# EAGLE design twin coil rev 3 20170625c (EAGLE 7.3.0)
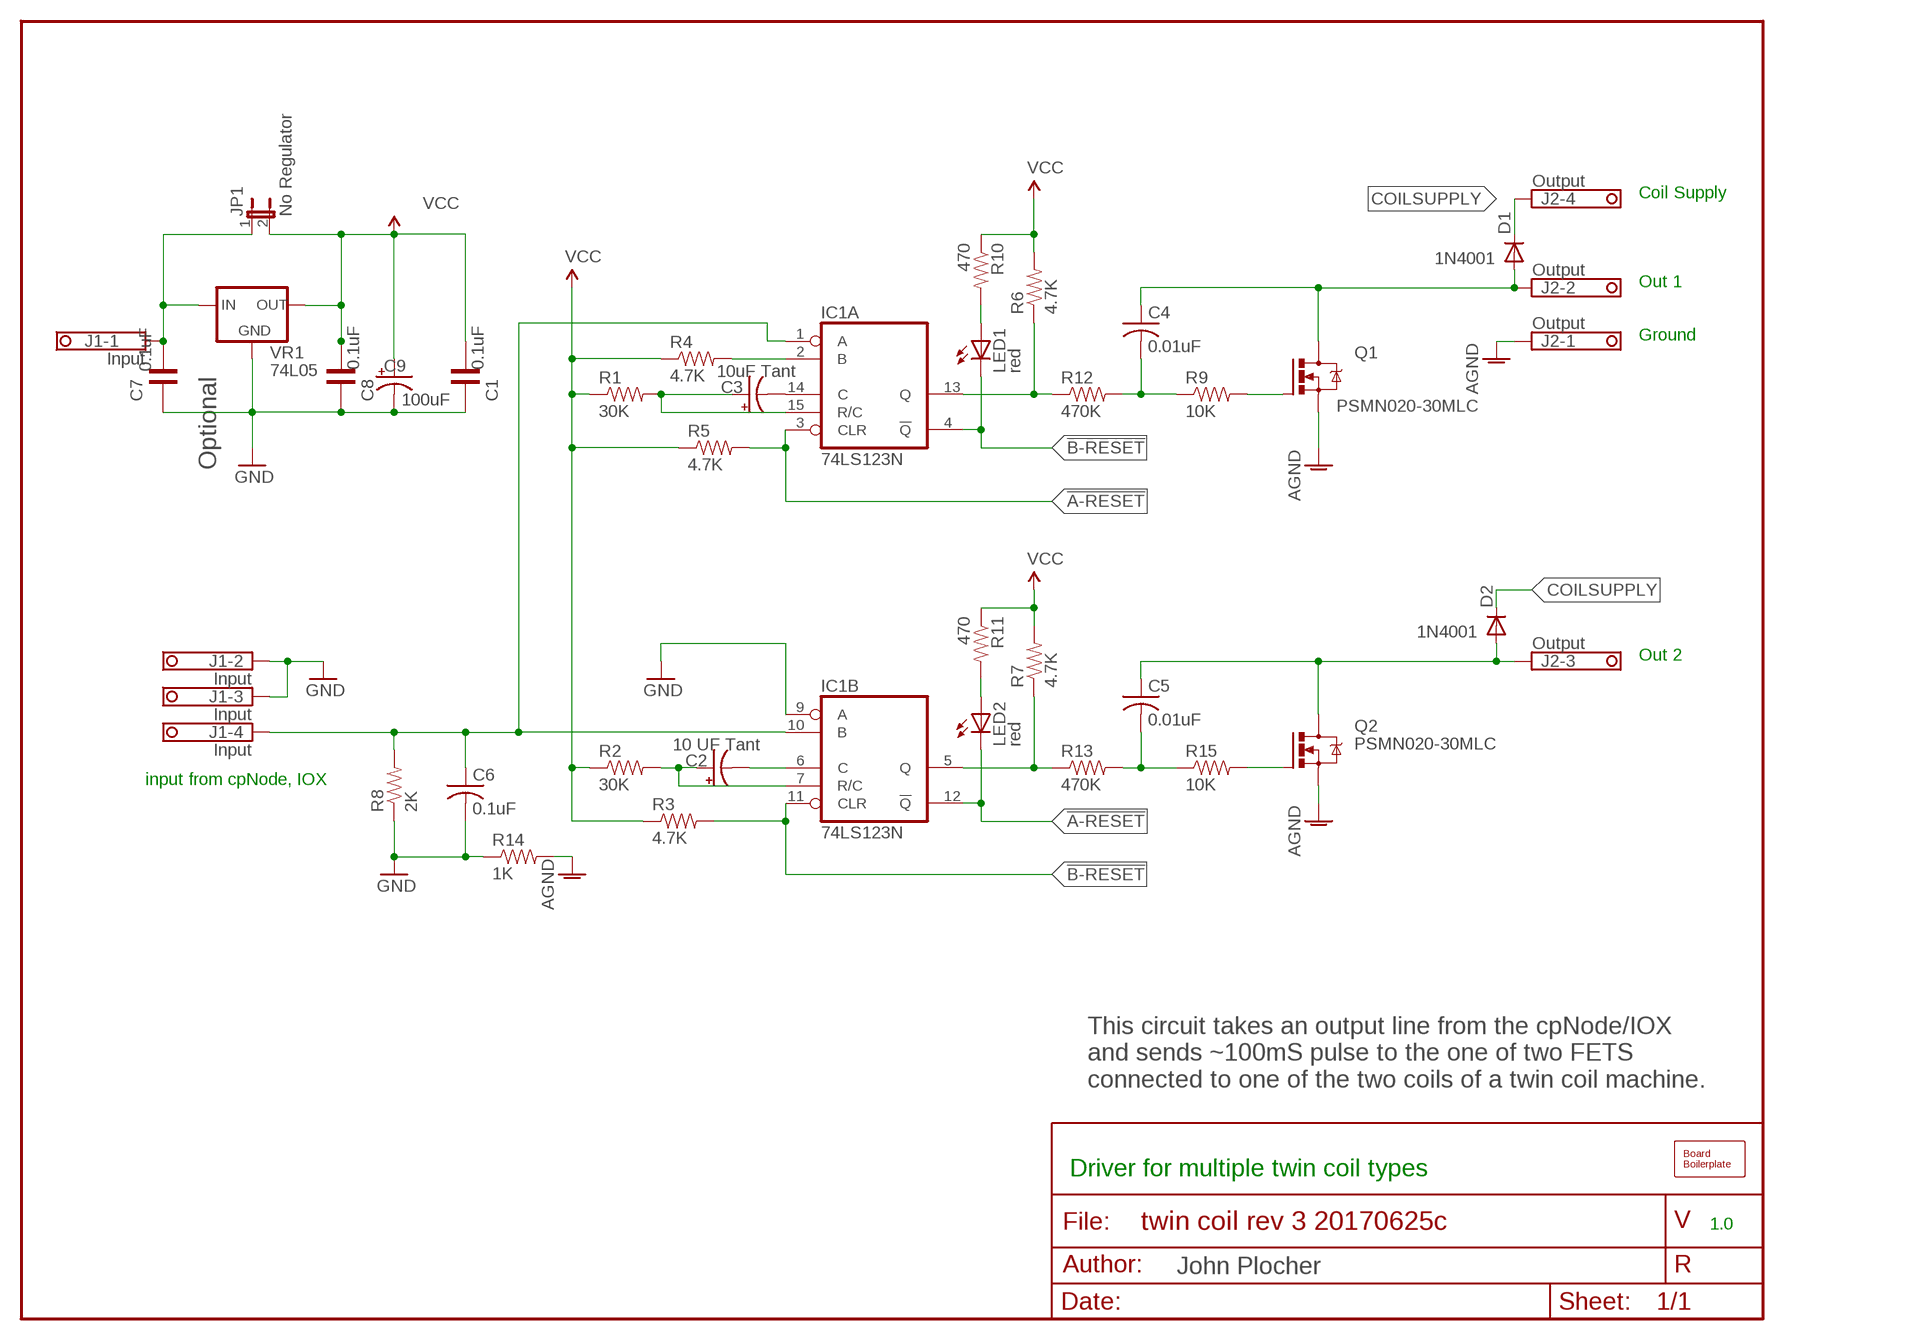
[diagram p0: schematic, sheet 1]

## Parts
BOARD1  BOARD69X70  [BOARD-DINRAIL-2.7INX7CM]
C1  0.1uF  CPTH  [CAP-PTH-SMALL]
C2  10 UF Tant  CPOL-USE5-4  [E5-4]
C3  10uF Tant  CPOL-USE5-4  [E5-4]
C4  0.01uF  C-US025-030X050  [C025-030X050]
C5  0.01uF  C-US025-030X050  [C025-030X050]
C6  0.1uF  C-US025-030X050  [C025-030X050]
C7  0.1uF  CPTH  [CAP-PTH-SMALL]
C8  0.1uF  CPTH  [CAP-PTH-SMALL]
C9  100uF  CPOL-USE3.5-10  [E3,5-10]
D1  1N4001  DIODEPTH  [DIODE-1N4001]
D2  1N4001  DIODEPTH  [DIODE-1N4001]
IC1  74LS123N  [DIL16]
J1  Input  1751264  [1751264]
J2  Output  1751264  [1751264]
JP1  No Regulator  JUMPER-2PTH_LOCK  [1X02_LOCK]
LED1  red  LED3MM  [LED3MM]
LED2  red  LED3MM  [LED3MM]
Q1  PSMN020-30MLC  STP5NA50  [TO220BV]
Q2  PSMN020-30MLC  STP5NA50  [TO220BV]
R1  30K  RESISTORPTH-1/4W  [AXIAL-0.4]
R2  30K  RESISTORPTH-1/4W  [AXIAL-0.4]
R3  4.7K  RESISTORPTH-1/4W  [AXIAL-0.4]
R4  4.7K  RESISTORPTH-1/4W  [AXIAL-0.4]
R5  4.7K  RESISTORPTH-1/4W  [AXIAL-0.4]
R6  4.7K  RESISTORPTH-1/4W  [AXIAL-0.4]
R7  4.7K  RESISTORPTH-1/4W  [AXIAL-0.4]
R8  2K  RESISTORPTH-1/4W  [AXIAL-0.4]
R9  10K  RESISTORPTH-1/4W  [AXIAL-0.4]
R10  470  RESISTORPTH-1/4W  [AXIAL-0.4]
R11  470  RESISTORPTH-1/4W  [AXIAL-0.4]
R12  470K  RESISTORPTH-1/4W  [AXIAL-0.4]
R13  470K  RESISTORPTH-1/4W  [AXIAL-0.4]
R14  1K  RESISTORPTH-1/4W  [AXIAL-0.4]
R15  10K  RESISTORPTH-1/4W  [AXIAL-0.4]
VR1  74L05  V_REG_78XXTO-92_UNTESTED  [TO-92]

## Nets
!A-RESET: IC1.3(A:CLR) IC1.12(B:!Q) LED2.K(C) R5.P$2
!B-RESET: IC1.4(A:!Q) IC1.11(B:CLR) LED1.K(C) R3.P$2
AGND: J2.1 Q1.S Q2.S R14.P$2
COILSUPPLY: D1.C D2.C J2.4
FETDRIVE1: Q1.G R9.P$2
GND [Power]: C1.1 C6.2 C7.1 C8.1 C9.- IC1.9(B:A) J1.2 J1.3 R8.P$1 R14.P$1 VR1.2(GND)
INPUT: C6.1 IC1.1(A:A) IC1.10(B:B) J1.4 R8.P$2
N$1: IC1.13(A:Q) R6.P$1 R12.P$1
N$2: IC1.5(B:Q) R7.P$1 R13.P$1
N$3: Q2.G R15.P$2
N$5: IC1.2(A:B) R4.P$2
N$7: C3.- IC1.14(A:C)
N$8: C2.- IC1.6(B:C)
N$9: C3.+ IC1.15(A:R/C) R1.P$2
N$10: C2.+ IC1.7(B:R/C) R2.P$2
N$12: C4.2 R9.P$1 R12.P$2
N$15: C5.2 R13.P$2 R15.P$1
N$19: LED1.A R10.P$2
N$20: LED2.A R11.P$2
OUT1: C4.1 D1.A J2.2 Q1.D
OUT2: C5.1 D2.A J2.3 Q2.D
V+ [Power]: C7.2 J1.1 JP1.1 VR1.3(IN)
VCC: C1.2 C8.2 C9.+ JP1.2 R1.P$1 R2.P$1 R3.P$1 R4.P$1 R5.P$1 R6.P$2 R7.P$2 R10.P$1 R11.P$1 VR1.1(OUT)

## Notes on the sheet
- Coil Supply
- Out 1
- Ground
- Optional
- Out 2
- input from cpNode, IOX
- This circuit takes an output line from the cpNode/IOX
  and sends ~100mS pulse to the one of two FETS
  connected to one of the two coils of a twin coil machine.
- Driver for multiple twin coil types
- 1.0

## Power pins joined to a net without a drawn wire
GND: IC1.8(P:GND)
VCC: IC1.16(P:VCC)

## Library data of the parts
BOARD1 = SPCoast:BOARD
C1 C7 C8 = SPCoast:C*: Capacitor Standard 0603 ceramic capacitor, and 0.1" leaded capacitor.
C2 C3 C9 = rcl:CPOL-US: POLARIZED CAPACITOR, American symbol
C4-C6 = rcl:C-US: CAPACITOR, American symbol
D1 D2 = SPCoast:DIODE: Diode These are standard reverse protection diodes and small signal diodes. SMA package can handle up to about 1A. SOD-323 can handle about 200mA. What the SOD-323 package when ordering, there are some mfgs out there that are 5-pin packages.
IC1 = 74xx-us:74*123: Retriggerable monostable MULTIVIBRATOR
J1 J2 = mschutzer:1751264: MKDS 1/ 4-3,5 Printklemme Nennstrom: 10 A Bemessungsspannung: 160 V Raster: 3,5 mm Polzahl: 4 Montageart: Löten Anschlussart: Schraubanschluss Anschlussrichtung vom Leiter zur Platine: 0° Source: http://eshop.phoenixcontact.com .. 1751264.pdf; MPN: 1751264; OC_FARNELL: unknown; OC_NEWARK: 10R0934
JP1 = SPCoast:JUMPER-2: Jumper Basic 0.1" spaced jumper. Use with breakaway headers.
LED1 LED2 = led:LED: LED OSRAM: - CHIPLED LG R971, LG N971, LY N971, LG Q971, LY Q971, LO R971, LY R971 LH N974, LH R974 LS Q976, LO Q976, LY Q976 LO Q996 - Hyper CHIPLED LW Q18S LB Q993, LB Q99A, LB R99A - SideLED LS A670, LO A670, LY A670, LG A670, LP A670 LB A673, LV A673, LT A673, LW A673 LH A674 LY A675 LS A676, LA A676, LO A676, LY A676, LW A676 LS A679, LY A679, LG A679 - Hyper Micro SIDELED® LS Y876, LA Y876, LO Y876, LY Y876 LT Y87S - SmartLED LW L88C, LW L88S LB L89C, LB L89S, LG L890 LS L89K, LO L89K, LY L89K LS L896, LA L896, LO L896, LY L896 - TOPLED LS T670, LO T670, LY T670, LG T670, LP T670 LSG T670, LSP T670, LSY T670, LOP T670, LYG T670 LG T671, LOG T671, LSG T671 LB T673, LV T673, LT T673, LW T673 LH T674 LS T676, LA T676, LO T676, LY T676, LB T676, LH T676, LSB T676, LW T676 LB T67C, LV T67C, LT T67C, LS T67K, LO T67K, LY T67K, LW E67C LS E67B, LA E67B, LO E67B, LY E67B, LB E67C, LV E67C, LT E67C LW T67C LS T679, LY T679, LG T679 LS T770, LO T770, LY T770, LG T770, LP T770 LB T773, LV T773, LT T773, LW T773 LH T774 LS E675, LA E675, LY E675, LS T675 LS T776, LA T776, LO T776, LY T776, LB T776 LHGB T686 LT T68C, LB T68C - Hyper Mini TOPLED® LB M676 - Mini TOPLED Santana® LG M470 LS M47K, LO M47K, LY M47K Source: http://www.osram.convergy.de LUXEON: - LUMILED® LXK2-PW12-R00, LXK2-PW12-S00, LXK2-PW14-U00, LXK2-PW14-V00 LXK2-PM12-R00, LXK2-PM12-S00, LXK2-PM14-U00 LXK2-PE12-Q00, LXK2-PE12-R00, LXK2-PE12-S00, LXK2-PE14-T00, LXK2-PE14-U00 LXK2-PB12-K00, LXK2-PB12-L00, LXK2-PB12-M00, LXK2-PB14-N00, LXK2-PB14-P00, LXK2-PB14-Q00 LXK2-PR12-L00, LXK2-PR12-M00, LXK2-PR14-Q00, LXK2-PR14-R00 LXK2-PD12-Q00, LXK2-PD12-R00, LXK2-PD12-S00 LXK2-PH12-R00, LXK2-PH12-S00 LXK2-PL12-P00, LXK2-PL12-Q00, LXK2-PL12-R00 Source: www.luxeon.com KINGBRIGHT: KA-3528ASYC Source: www.kingbright.com
Q1 Q2 = transistor-power:STP5NA50: N-CHANNEL MOS FET
R1-R15 = SparkFun-Passives:RESISTOR: Resistor Basic schematic elements and footprints for 0603, 1206, and PTH resistors.
VR1 = SparkFun-PowerIC:V_REG_78XX: Voltage Regulator Standard 78xx regulator. IGO (Input Ground Output). Spark Fun Electronics SKU : COM-00107

## Net classes
0 default: width 0.406 mm
1 Power: width 0.813 mm, drill 0.508 mm, clearance 0.254 mm

## Board
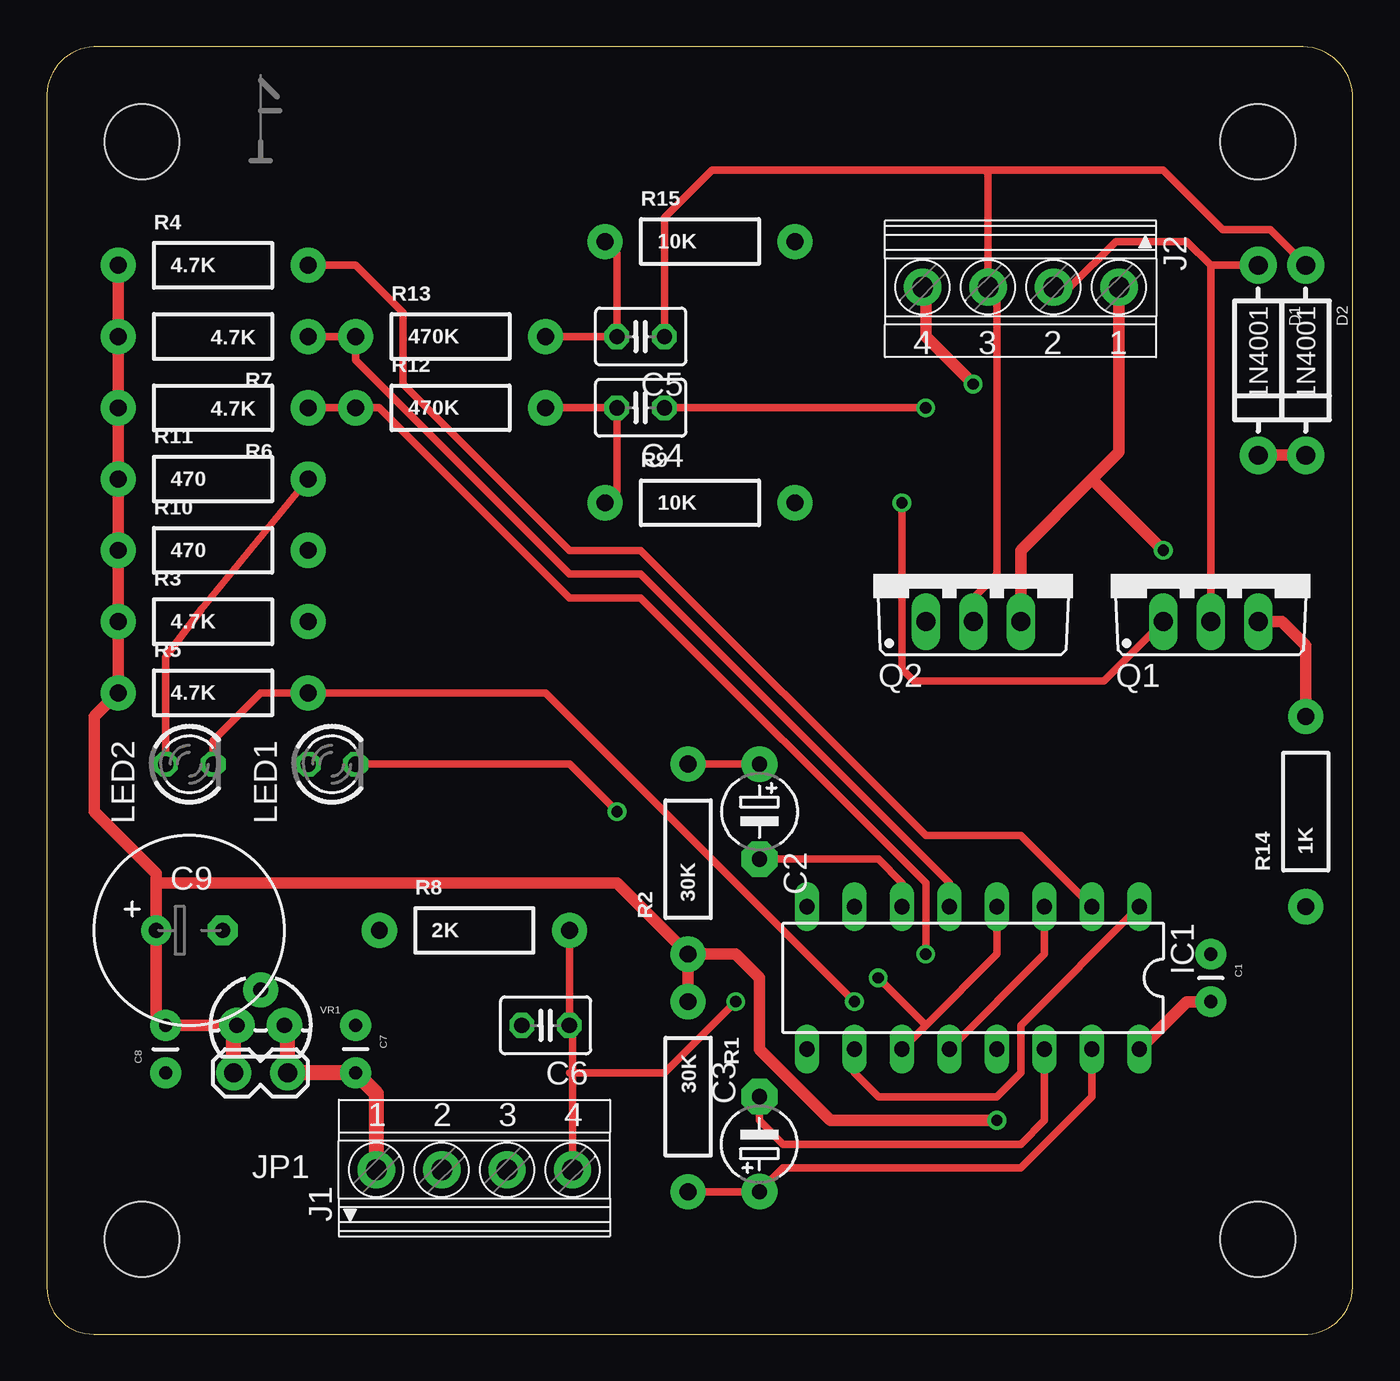
[diagram p1: board, top side]
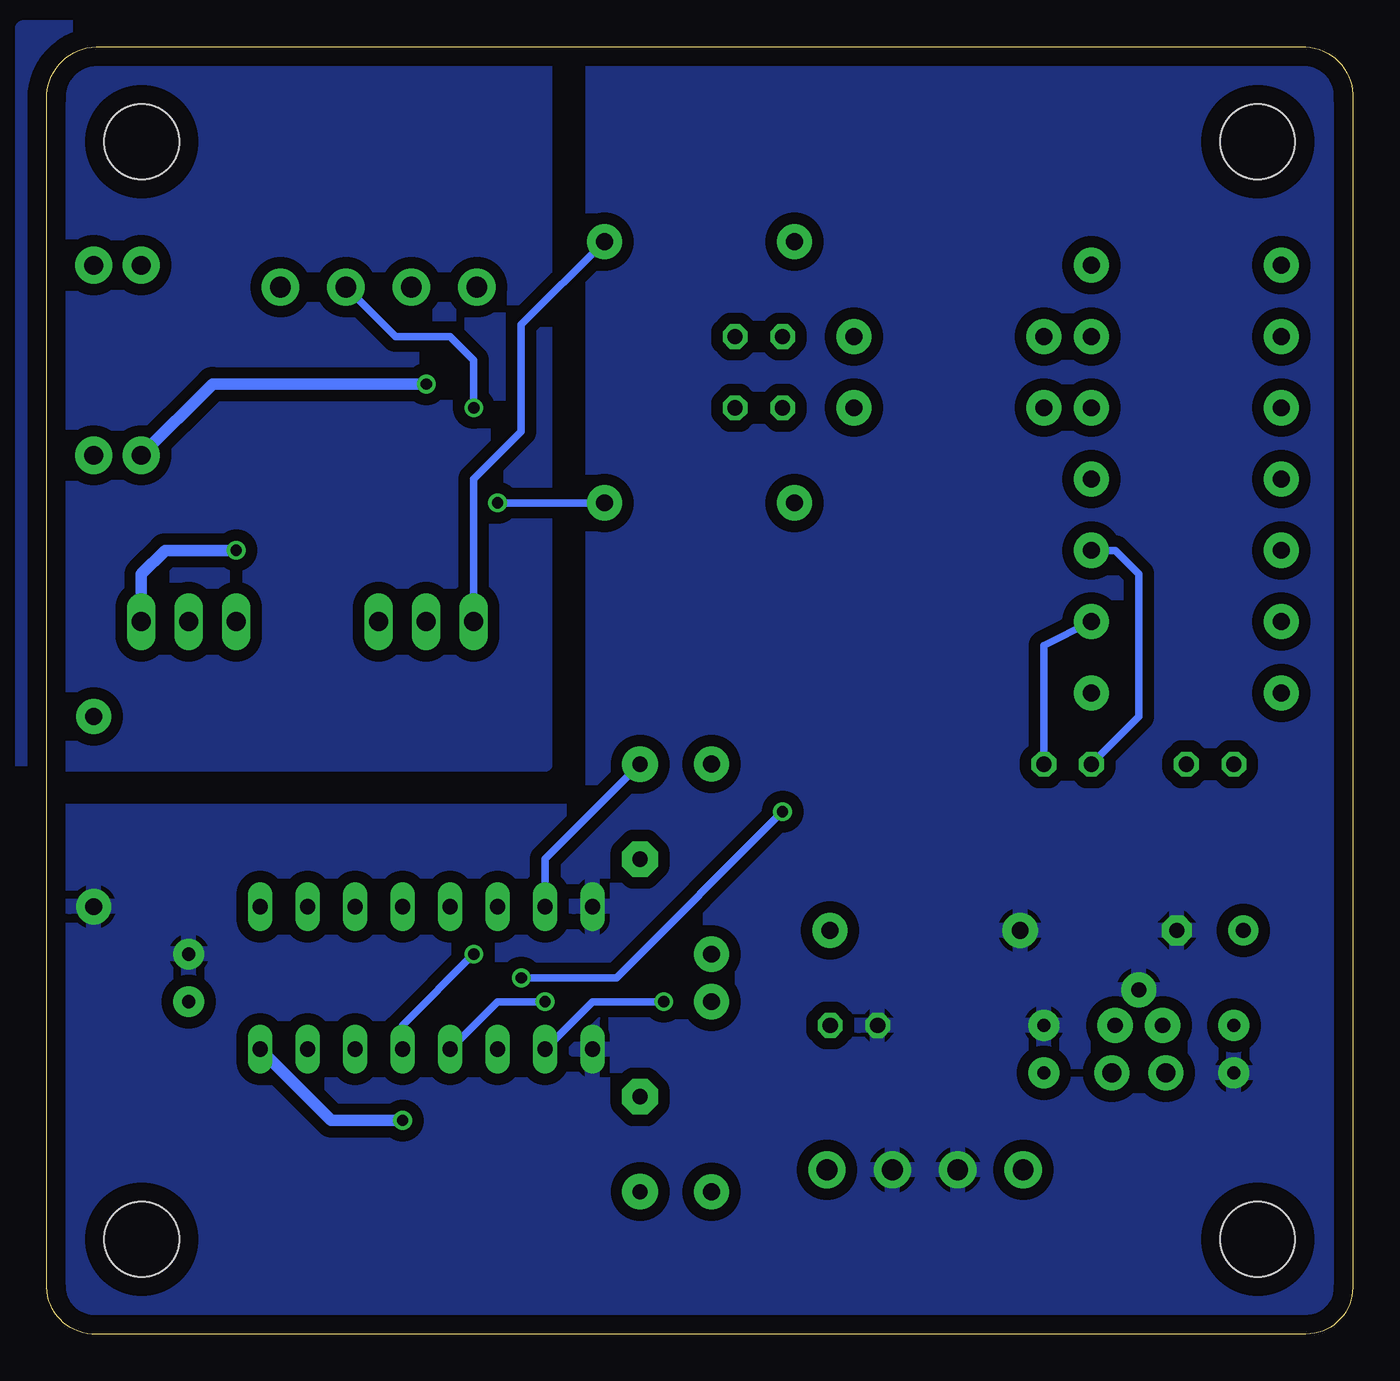
[diagram p2: board, bottom side, seen from below]

Size 69.82 x 68.83 mm. Coordinates in mm from the lower left corner, seen from the top.
Copper layers (1*16): Top 0.035mm / dielectric 1.5mm / Bottom 0.035mm
Design rules "default": minimum track width 10mil, minimum drill 0.6mm, track to track 8mil, track to pad 8mil, pad to pad 8mil, via to via 8mil, smd to smd 8mil, copper to edge 40mil, drill to drill 8mil, minimum pad ring 10mil, minimum via ring 8mil, stop-mask expansion 4mil, vias tented up to drill 0mil, thermal gap 10mil

### Footprints (pad centres in the part's own frame; a part is rotated, then mirrored left to right if it is on the bottom)
BOARD-DINRAIL-2.7INX7CM = hole 4: 64.742,5.08; 5.08,63.754; 64.742,63.754; 5.08,5.08
CAP-PTH-SMALL = drill 0.7 pad 1.651: 1 0,0; 2 2.54,0
E5-4 = drill 0.813 pad 1.905: + -2.54,0 | drill 0.813 pad 1.905 octagon: - 2.54,0
C025-030X050 = drill 0.813 octagon: 1 -1.27,0; 2 1.27,0
E3,5-10 = drill 0.813 pad 1.6: + -1.778,0 | drill 0.813 pad 1.6 octagon: - 1.778,0
DIODE-1N4001 = drill 1 pad 1.981: A -5.08,0; C 5.08,0
DIL16 = drill 0.813 long: 1 -8.89,-3.81; 2 -6.35,-3.81; 3 -3.81,-3.81; 4 -1.27,-3.81; 5 1.27,-3.81; 6 3.81,-3.81; 7 6.35,-3.81; 8 8.89,-3.81; 9 8.89,3.81; 10 6.35,3.81; 11 3.81,3.81; 12 1.27,3.81; 13 -1.27,3.81; 14 -3.81,3.81; 15 -6.35,3.81; 16 -8.89,3.81
1751264 = drill 1.1 pad 2: 1 -5.25,-0.1; 2 -1.75,-0.1; 3 1.75,-0.1; 4 5.25,-0.1
1X02_LOCK = drill 1.016 pad 1.88: 1 -0.178,0; 2 2.718,0
LED3MM = drill 0.813 octagon: A -1.27,0; K 1.27,0
TO220BV = drill 1.016 long: D 0,-2.54; G -2.54,-2.54; S 2.54,-2.54
AXIAL-0.4 = drill 0.9 pad 1.88: P$1 -5.08,0; P$2 5.08,0
TO-92 = drill 0.813 pad 1.88: 1 -1.27,0; 2 0,1.905; 3 1.27,0

### Placement (x,y rotation side)
BOARD1  0,0 0 top
C1  62.23,20.32 270 top
C2  38.1,27.94 270 top
C3  38.1,10.16 90 top
C4  31.75,49.53 180 top
C5  31.75,53.34 180 top
C6  26.67,16.51 180 top
C7  16.51,16.51 270 top
C8  6.35,13.97 90 top
C9  7.62,21.59 0 top
D1  64.77,52.07 270 top
D2  67.31,52.07 270 top
IC1  49.53,19.05 180 top
J1  22.86,8.89 0 top
J2  52.07,55.88 180 top
JP1  12.7,13.97 180 top
LED1  15.24,30.48 0 top
LED2  7.62,30.48 0 top
Q1  62.23,40.64 0 top
Q2  49.53,40.64 0 top
R1  34.29,12.7 270 top
R2  34.29,25.4 90 top
R3  8.89,38.1 0 top
R4  8.89,57.15 0 top
R5  8.89,34.29 0 top
R6  8.89,49.53 180 top
R7  8.89,53.34 180 top
R8  22.86,21.59 0 top
R9  34.93,44.45 0 top
R10  8.89,41.91 0 top
R11  8.89,45.72 0 top
R12  21.59,49.53 0 top
R13  21.59,53.34 0 top
R14  67.31,27.94 90 top
R15  34.93,58.42 0 top
U$1  [CA-PROP65WARNING]  57.79,29.21 0 top
U$2  [MRCSLOGOTOP]  10.16,62.23 0 top
VR1  11.43,16.51 0 top

### Tracks (layer width: path | path; a pad name or v marks a point on that pad's centre or on a via)
!A-RESET  (via drill 0.6)
  Top 0.406: LED2.K 8.89,31.75 11.43,34.29 R5.P$2 26.67,34.29 v43.18,17.78 | IC1.12 53.34,20.32 IC1.3
  Bottom 0.406: v43.18,17.78 45.72,17.78 IC1.12
!B-RESET  (via drill 0.6)
  Top 0.406: IC1.11 46.99,16.51 | 46.99,16.51 50.8,20.32 IC1.4 | LED1.K 27.94,30.48 v30.48,27.94 | 46.99,16.51 v44.45,19.05
  Bottom 0.406: v30.48,27.94 39.37,19.05 v44.45,19.05 | R3.P$2 16.51,36.83 LED1.K
AGND  (via drill 0.6)
  Top 0.61: J2.1 57.32,47.16 55.88,45.72 | 55.88,45.72 52.07,41.91 Q2.S | Q1.S 66.04,38.1 67.31,36.83 R14.P$2 | v59.69,41.91 55.88,45.72
  Bottom 0.61: v59.69,41.91 63.5,41.91 64.77,40.64 Q1.S
COILSUPPLY  (via drill 0.6)
  Top 0.61: D1.C D2.C | v49.53,50.8 46.99,53.34 46.99,55.81 J2.4
  Bottom 0.61: v49.53,50.8 60.96,50.8 D1.C
FETDRIVE1  (via drill 0.6)
  Top 0.406: Q1.G 56.52,34.92 46.36,34.92 45.72,35.56 v45.72,44.45
  Bottom 0.406: v45.72,44.45 R9.P$2
GND
  pour Bottom (isolate 0.61): 0,69.85 40.64,69.85 40.64,27.94 69.85,27.94 69.85,0 0,0
INPUT  (via drill 0.6)
  Top 0.406: 28.11,13.97 28.11,16.34 C6.1 R8.P$2 | 28.11,13.97 J1.4 | IC1.1 52.07,16.51 52.07,13.97 50.8,12.7 44.45,12.7 43.18,13.97 IC1.10 | v36.83,17.78 33.02,13.97 28.11,13.97 | 27.94,13.97 28.11,13.97
  Bottom 0.406: v36.83,17.78 40.64,17.78 IC1.10
N$1  (via drill 0.6)
  Top 0.406: R6.P$1 R12.P$1 17.78,49.53 27.94,39.37 31.75,39.37 46.99,24.13 v46.99,20.32
  Bottom 0.406: v46.99,20.32 50.8,16.51 IC1.13
N$2
  Top 0.406: R7.P$1 R13.P$1 16.51,52.07 27.94,40.64 31.75,40.64 48.26,24.13 IC1.5
N$3
  Bottom 0.406: R15.P$2 44.45,53.98 44.45,48.26 46.99,45.72 Q2.G
N$5
  Top 0.406: R4.P$2 16.51,57.15 19.05,54.61 19.05,50.8 27.94,41.91 31.75,41.91 46.99,26.67 52.07,26.67 IC1.2
N$7
  Top 0.406: C3.- 38.1,11.43 39.37,10.16 52.07,10.16 53.34,11.43 IC1.14
N$8
  Top 0.406: C2.- 44.45,25.4 45.72,24.13 IC1.6
N$9
  Top 0.406: R1.P$2 C3.+ 39.37,8.89 52.07,8.89 55.88,12.7 IC1.15
N$10
  Top 0.406: R2.P$2 C2.+
  Bottom 0.406: C2.+ 43.18,25.4 IC1.7
N$12
  Top 0.406: R12.P$2 C4.2 30.48,45.09 R9.P$1
N$15
  Top 0.406: R13.P$2 C5.2 30.48,57.78 R15.P$1
N$19
  Bottom 0.406: LED1.A 11.43,33.02 11.43,40.64 12.7,41.91 R10.P$2
N$20
  Top 0.406: LED2.A 6.35,36.2 8.26,38.73 R11.P$2
OUT1  (via drill 0.6)
  Top 0.406: D1.A 62.23,57.15 | Q1.D 62.23,57.15 | J2.2 54.71,55.98 57.15,58.42 60.96,58.42 62.23,57.15 | C4.1 v46.99,49.53
  Bottom 0.406: J2.2 51.18,53.34 48.26,53.34 46.99,52.07 v46.99,49.53
OUT2
  Top 0.406: 50.17,62.23 59.69,62.23 62.87,59.05 65.41,59.05 D2.A | C5.1 33.02,59.69 35.56,62.23 50.17,62.23 | Q2.D 49.53,39.37 50.8,40.64 50.8,55.5 J2.3 50.32,62.08 50.17,62.23
RTN
  pour Bottom (isolate 0.61): 71.12,30.48 43.18,30.48 43.18,69.85 71.12,69.85
V+
  Top 0.813: VR1.3 12.88,16.33 JP1.1 C7.2 17.61,12.87 J1.1
VCC  (via drill 0.6)
  Top 0.61: R4.P$1 R7.P$2 R6.P$2 R11.P$1 R10.P$1 R3.P$1 R5.P$1 2.54,33.02 2.54,27.94 5.84,24.64 5.84,24.13 | R1.P$1 R2.P$1 | 5.84,24.13 C9.+ 5.84,17.02 C8.2 VR1.1 | R2.P$1 30.48,24.13 5.84,24.13 | R2.P$1 36.83,20.32 38.1,19.05 38.1,15.24 41.91,11.43 v50.8,11.43 | C1.2 60.96,17.78 IC1.16
  Top 0.813: JP1.2 9.98,16.33 VR1.1
  Bottom 0.61: v50.8,11.43 54.61,11.43 IC1.16

### Text on the board
tDocu: COIL / OUT2 / OUT1 / RTN | Seth Neumann / John Plocher / Mark Gurries / 20170625 | PWR / GND / GND / IN